# Altium schematic sheet 8_USB_Hub.SchDoc: Apalis Evaluation Board 1.1
size A3; Organization: Toradex AG; Address1: Altsagenstrasse 5; Address2: Horw; Address3: 6048; Address4: Switzerland; DocumentNumber: 6; Revision: V1.1; SheetNumber: 6; SheetTotal: 32; PageSetup: Record=PageOptions|CenterHorizontal=True|CenterVertical=True|PrintScale=0.71|XCorrection=1.00|YCorrection=1.00|PrintKind=0|BorderSize=5000000|LeftOffset=0|BottomOffset=0|Orientation=2|PaperLength=1000|PaperWidth=1000|Scale=100|PaperSource=7|PrintQuality=-4|MediaType=1|DitherType=10|PaperKind=A4|PrintScaleMode=1
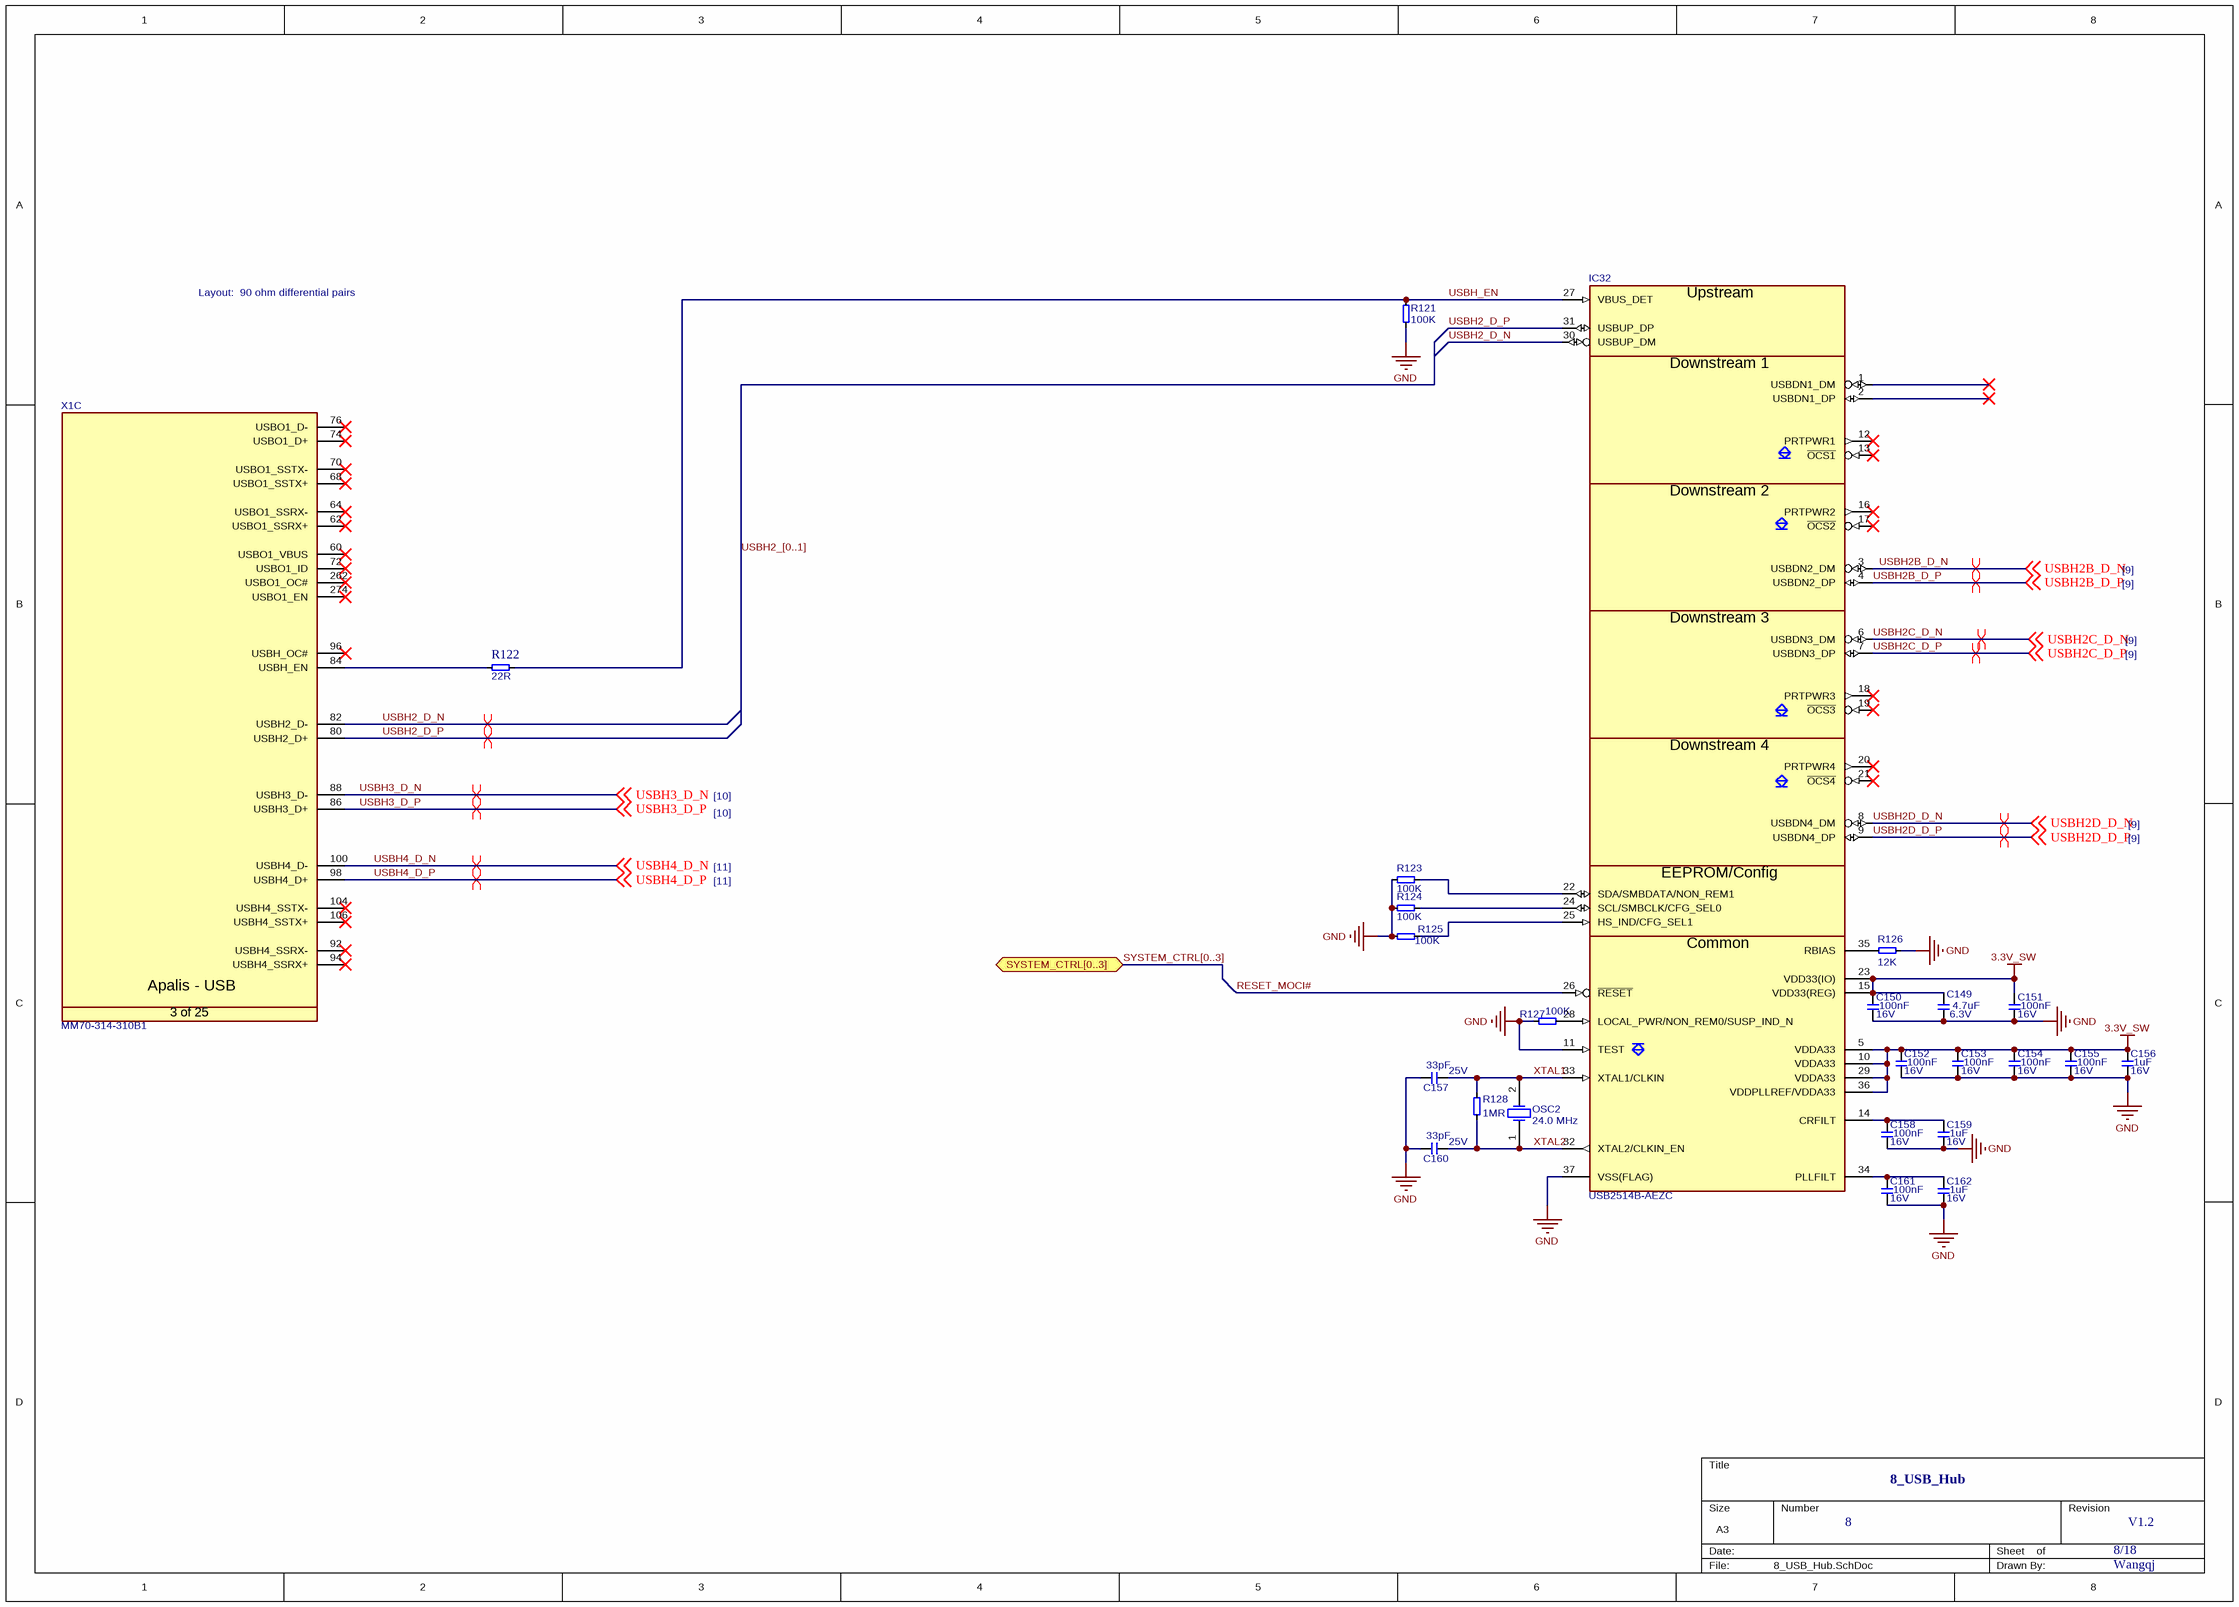
[diagram p0: 8_USB_Hub.SchDoc]

## Parts
C149  Rating: 6.3V  [T_CAPC0603X33N]  (hidden comment: 4.7uF)
C150  Rating: 16V  [T_CAPC0603X33N]  (hidden comment: 100nF)
C151  Rating: 16V  [T_CAPC0603X33N]  (hidden comment: 100nF)
C152  Rating: 16V  [T_CAPC0603X33N]  (hidden comment: 100nF)
C153  Rating: 16V  [T_CAPC0603X33N]  (hidden comment: 100nF)
C154  Rating: 16V  [T_CAPC0603X33N]  (hidden comment: 100nF)
C155  Rating: 16V  [T_CAPC0603X33N]  (hidden comment: 100nF)
C156  Rating: 16V  [T_CAPC0603X33N]  (hidden comment: 1uF)
C157  Rating: 25V  [T_CAPC0603X33N]  (hidden comment: 33pF)
C158  Rating: 16V  [T_CAPC0603X33N]  (hidden comment: 100nF)
C159  Rating: 16V  [T_CAPC0603X33N]  (hidden comment: 1uF)
C160  Rating: 25V  [T_CAPC0603X33N]  (hidden comment: 33pF)
C161  Rating: 16V  [T_CAPC0603X33N]  (hidden comment: 100nF)
C162  Rating: 16V  [T_CAPC0603X33N]  (hidden comment: 1uF)
IC32  Manufacturer Part No.: USB2514B-AEZC  [T_SMSC_USB2514B-AEZC]  (hidden comment: USB2514B)
OSC2  value 24.0 MHz  [SMD-5032_2P]  (hidden comment: HEX24-24000MHz-18-50R-F-H2-T2-W2-T)
R121  100K  [T_RESC0603X30N]
R122  22R  [T_RESC0603X30N]
R123  100K  [T_RESC0603X30N]
R124  100K  [T_RESC0603X30N]
R125  100K  [T_RESC0603X30N]
R126  12K  [T_RESC0603X30N]
R127  100K  [T_RESC0603X30N]
R128  1MR  [T_RESC0603X30N]
X1  Manufacturer Part No.: MM70-314-310B1  [T_JAE_MM70-314-310B1]  (hidden comment: CON-JAE-MM70-314-310B1-314-0.5mm)  (part C of 25)

## Ports
SYSTEM_CTRL[0..3] (bidir)

## Nets
3.3V_SW: C149.2 C150.2 C151.2 C152.2 C153.2 C154.2 C155.2 C156.2 IC32.5(VDDA33) IC32.10(VDDA33) IC32.15(VDD33(REG)) IC32.23(VDD33(IO)) IC32.29(VDDA33) IC32.36(VDDPLLREF/VDDA33)
GND: C149.1 C150.1 C151.1 C152.1 C153.1 C154.1 C155.1 C156.1 C157.1 C158.1 C159.1 C160.1 C161.1 C162.1 IC32.11(TEST) IC32.37(VSS(FLAG)) R121.1 R123.2 R124.2 R125.2 R126.1 R127.1
RESET_MOCI#: IC32.26(~{RESET})
USBH2_D_N: IC32.30(USBUP_DM) X1.82(USBH2_D-)
USBH2_D_P: IC32.31(USBUP_DP) X1.80(USBH2_D+)
USBH2B_D_N: IC32.3(USBDN2_DM) ; off-sheet USBH2B_D_N
USBH2B_D_P: IC32.4(USBDN2_DP) ; off-sheet USBH2B_D_P
USBH2C_D_N: IC32.6(USBDN3_DM) ; off-sheet USBH2C_D_N
USBH2C_D_P: IC32.7(USBDN3_DP) ; off-sheet USBH2C_D_P
USBH2D_D_N: IC32.8(USBDN4_DM) ; off-sheet USBH2D_D_N
USBH2D_D_P: IC32.9(USBDN4_DP) ; off-sheet USBH2D_D_P
USBH3_D_N: X1.88(USBH3_D-) ; off-sheet USBH3_D_N
USBH3_D_P: X1.86(USBH3_D+) ; off-sheet USBH3_D_P
USBH4_D_N: X1.100(USBH4_D-) ; off-sheet USBH4_D_N
USBH4_D_P: X1.98(USBH4_D+) ; off-sheet USBH4_D_P
USBH_EN: IC32.27(VBUS_DET) R121.2 R122.2
XTAL1: C157.2 IC32.33(XTAL1/CLKIN) OSC2.2(OSC2) R128.2
XTAL2: C160.2 IC32.32(XTAL2/CLKIN_EN) OSC2.1(OSC1) R128.1
NetC158_2: C158.2 C159.2 IC32.14(CRFILT)
NetC161_2: C161.2 C162.2 IC32.34(PLLFILT)
NetIC32_22: IC32.22(SDA/SMBDATA/NON_REM1) R123.1
NetIC32_24: IC32.24(SCL/SMBCLK/CFG_SEL0) R124.1
NetIC32_25: IC32.25(HS_IND/CFG_SEL1) R125.1
NetIC32_28: IC32.28(LOCAL_PWR/NON_REM0/SUSP_IND_N) R127.2
NetIC32_35: IC32.35(RBIAS) R126.2
NetR122_1: R122.1 X1.84(USBH_EN)

Not connected (* = marked no-connect by the designer): IC32 1(USBDN1_DM)* 2(USBDN1_DP)* 12(PRTPWR1)* 13(~{OCS1})* 16(PRTPWR2)* 17(~{OCS2})* 18(PRTPWR3)* 19(~{OCS3})* 20(PRTPWR4)* 21(~{OCS4})*; X1 60(USBO1_VBUS)* 62(USBO1_SSRX+)* 64(USBO1_SSRX-)* 68(USBO1_SSTX+)* 70(USBO1_SSTX-)* 72(USBO1_ID)* 74(USBO1_D+)* 76(USBO1_D-)* 92(USBH4_SSRX-)* 94(USBH4_SSRX+)* 96(USBH_OC#)* 104(USBH4_SSTX-)* 106(USBH4_SSTX+)* 262(USBO1_OC#)* 274(USBO1_EN)*

## Buses and harness runs
bus SYSTEM_CTRL[0..3] = port SYSTEM_CTRL[0..3]
bus USBH2_[0..1]

## Layout directives
differential pair: USBH2_D_N, USBH2_D_P, USBH2B_D_N, USBH2B_D_P, USBH2C_D_N, USBH2C_D_P, USBH2D_D_N, USBH2D_D_P, USBH3_D_N, USBH3_D_P, USBH4_D_N, USBH4_D_P

## Notes on the sheet
- Layout:  90 ohm differential pairs
- [9]
- [10]
- [11]
- 8_USB_Hub
- 8
- 8/18
- V1.2
- Wangqj
- Title
- Size:
- Date:
- A3
- Number:
- Time:
- Revision:
- Sheet
- of
- File:
- (in symbol CON-JAE-MM70-314-310B1-314-0.5mm, part C) Apalis - USB; 3 of 25
- (in symbol IC-SMSC-USB2514B-AEZC) Upstream; Downstream 1; Downstream 2; Downstream 3; Downstream 4; EEPROM/Config; Common

## Library data of the parts
C149 = C-X5R-4.7uF-6.3V-20%-0603: Capacitor Ceramic X5R 4.7uF 6.3V 20% 0603; Tolerance: 20%; Type: X5R; Value: 4.7uF
C150-C155 C158 C161 = C-X7R-100nF-16V-10%-0603: Capacitor Ceramic X7R 100nF 16V 10% 0603; Tolerance: 10%; Type: X7R; Value: 100nF
C156 C159 C162 = C-X5R-1uF-16V-20%-0603: Capacitor Ceramic X5R 1uF 16V 20% 0603; Tolerance: 20%; Type: X5R; Value: 1uF
C157 C160 = C-NP0-33pF-25V-10%-0603: Capacitor Ceramic NP0 33pF 25V 10% 0603; Tolerance: 10%; Type: NP0; Value: 33pF
IC32 = IC-SMSC-USB2514B-AEZC: 4 Port USB HUB; Manufacturer Name: SMSC
OSC2 = OSC-HORIZON-HEX24-24000MHz-18-50R-F-H2-T2-W2-T: Quartz 24.0 MHz; Tolerance: 30ppm; Manufacturer Name: HORIZON; Manufacturer Part No.: HEX24-24000MHz-18-50R-F-H2-T2-W2-T
R121 R123-R125 R127 = R-100KR-63mW-5%-0603: Resistor 100 Kohm 63mW 5% 0603; Value: 100KR; Rating: 63mW; Tolerance: 5%
R122 = R-22R-63mW-5%-0603: Resistor 22 ohm 63mW 5% 0603; Rating: 63mW; Tolerance: 5%; Value: 22R
R126 = R-12KR-63mW-1%-0603: Resistor 12 Kohm 63mW 1% 0603; Value: 12KR; Rating: 63mW; Tolerance: 1%
R128 = R-1MR-63mW-5%-0603: Resistor 1Mohm 63mW 5% 0603; Rating: 63mW; Tolerance: 5%; Value: 1MR
X1 = CON-JAE-MM70-314-310B1-314-0.5mm: MXM3 Connector; Manufacturer Name: JAE; No. of ways: 314